# EAGLE schematic FloppyController (EAGLE 7.3.0)
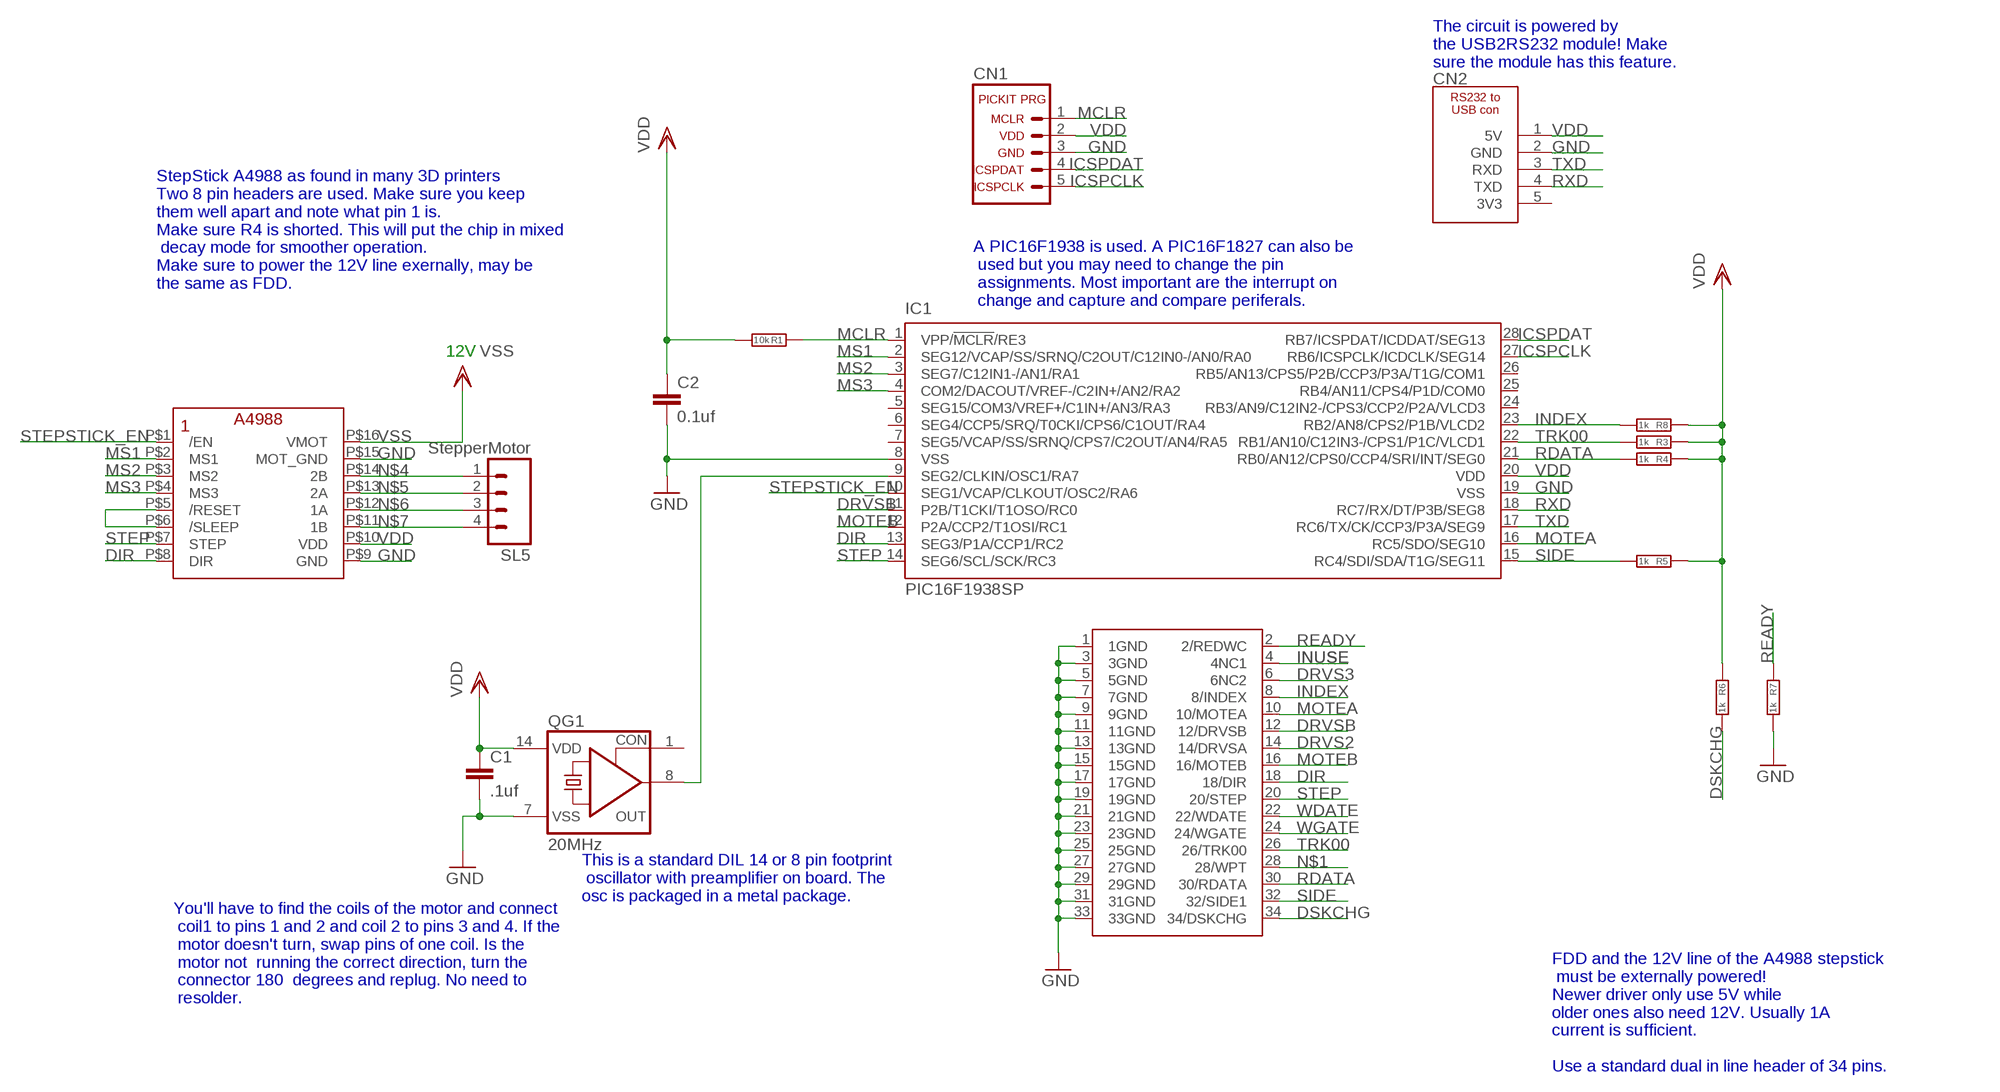
[diagram p0: schematic, sheet 1]

## Parts
C1  .1uf  C5/3  [C5B3]
C2  0.1uf  C5/3  [C5B3]
CN1  PICKIT3CONNECTOR  [05P]
CN2  RS232_TO_USB_CONNECTOR  [05P]
IC1  PIC16F1938SP  [DIL28-3]
IC2  STEPSTICK_A4988  [STEPSTICK_A4988]
QG1  20MHz  CRYSTAL_RES-SG51  [SG51]
R1  10k  R-EU_M1206  [M1206]
R3  1k  R-EU_M1206  [M1206]
R4  1k  R-EU_M1206  [M1206]
R5  1k  R-EU_M1206  [M1206]
R6  1k  R-EU_M1206  [M1206]
R7  1k  R-EU_M1206  [M1206]
R8  1k  R-EU_M1206  [M1206]
SL5  StepperMotor  M04  [04P]
U$1  FLOPPY_34PIN_CONN  [FLOPPY_34PIN_DUALROW]

## Nets
DIR: IC1.13(SEG3/P1A/CCP1/RC2) IC2.P$8(DIR) U$1.18(18/DIR)
DRVS2: U$1.14(14/DRVSA)
DRVS3: U$1.6(6NC2)
DRVSB: IC1.11(P2B/T1CKI/T1OSO/RC0) U$1.12(12/DRVSB)
DSKCHG: R6.1 U$1.34(34/DSKCHG)
GND: C1.2 C2.2 CN1.3(3_GND) CN2.2(GND) IC1.8(VSS) IC1.19(VSS) IC2.P$9(GND) IC2.P$15(MOT_GND) QG1.7(VSS) R7.1 U$1.1(1GND) U$1.3(3GND) U$1.5(5GND) U$1.7(7GND) U$1.9(9GND) U$1.11(11GND) U$1.13(13GND) U$1.15(15GND) U$1.17(17GND) U$1.19(19GND) U$1.21(21GND) U$1.23(23GND) U$1.25(25GND) U$1.27(27GND) U$1.29(29GND) U$1.31(31GND) U$1.33(33GND)
ICSPCLK: CN1.5(5_ICSPCLK) IC1.27(RB6/ICSPCLK/ICDCLK/SEG14)
ICSPDAT: CN1.4(4_ICSPDAT) IC1.28(RB7/ICSPDAT/ICDDAT/SEG13)
INDEX: IC1.23(RB2/AN8/CPS2/P1B/VLCD2) R8.1 U$1.8(8/INDEX)
INUSE: U$1.4(4NC1)
MCLR: CN1.1(1_MCLR) IC1.1(VPP/!MCLR!/RE3) R1.2
MOTEA: IC1.16(RC5/SDO/SEG10) U$1.10(10/MOTEA)
MOTEB: IC1.12(P2A/CCP2/T1OSI/RC1) U$1.16(16/MOTEB)
MS1: IC1.2(SEG12/VCAP/SS/SRNQ/C2OUT/C12IN0-/AN0/RA0) IC2.P$2(MS1)
MS2: IC1.3(SEG7/C12IN1-/AN1/RA1) IC2.P$3(MS2)
MS3: IC1.4(COM2/DACOUT/VREF-/C2IN+/AN2/RA2) IC2.P$4(MS3)
N$1: U$1.28(28/WPT)
N$4: IC2.P$14(2B) SL5.1
N$5: IC2.P$13(2A) SL5.2
N$6: IC2.P$12(1A) SL5.3
N$7: IC2.P$11(1B) SL5.4
N$14: IC1.9(SEG2/CLKIN/OSC1/RA7) QG1.8(OUT)
N$15: IC2.P$5(/RESET) IC2.P$6(/SLEEP)
RDATA: IC1.21(RB0/AN12/CPS0/CCP4/SRI/INT/SEG0) R4.1 U$1.30(30/RDATA)
READY: R7.2 U$1.2(2/REDWC)
RXD: CN2.4(TXD) IC1.18(RC7/RX/DT/P3B/SEG8)
SIDE: IC1.15(RC4/SDI/SDA/T1G/SEG11) R5.1 U$1.32(32/SIDE1)
STEP: IC1.14(SEG6/SCL/SCK/RC3) IC2.P$7(STEP) U$1.20(20/STEP)
STEPSTICK_EN: IC1.10(SEG1/VCAP/CLKOUT/OSC2/RA6) IC2.P$1(/EN)
TRK00: IC1.22(RB1/AN10/C12IN3-/CPS1/P1C/VLCD1) R3.1 U$1.26(26/TRK00)
TXD: CN2.3(RXD) IC1.17(RC6/TX/CK/CCP3/P3A/SEG9)
VDD: C1.1 C2.1 CN1.2(2_VDD) CN2.1(5V) IC1.20(VDD) IC2.P$10(VDD) QG1.14(VDD) R1.1 R3.2 R4.2 R5.2 R6.2 R8.2
VSS: IC2.P$16(VMOT)
WDATE: U$1.22(22/WDATE)
WGATE: U$1.24(24/WGATE)
Unconnected: CN2.5(3V3) IC1.5(SEG15/COM3/VREF+/C1IN+/AN3/RA3) IC1.6(SEG4/CCP5/SRQ/T0CKI/CPS6/C1OUT/RA4) IC1.7(SEG5/VCAP/SS/SRNQ/CPS7/C2OUT/AN4/RA5) IC1.24(RB3/AN9/C12IN2-/CPS3/CCP2/P2A/VLCD3) IC1.25(RB4/AN11/CPS4/P1D/COM0) IC1.26(RB5/AN13/CPS5/P2B/CCP3/P3A/T1G/COM1) QG1.1(CON)

## Notes on the sheet
- The circuit is powered by
  the USB2RS232 module! Make
  sure the module has this feature.
- StepStick A4988 as found in many 3D printers
  Two 8 pin headers are used. Make sure you keep
  them well apart and note what pin 1 is.
  Make sure R4 is shorted. This will put the chip in mixed
   decay mode for smoother operation.
  Make sure to power the 12V line exernally, may be 
  the same as FDD.
- A PIC16F1938 is used. A PIC16F1827 can also be
   used but you may need to change the pin
   assignments. Most important are the interrupt on
   change and capture and compare periferals.
- 12V
- This is a standard DIL 14 or 8 pin footprint
   oscillator with preamplifier on board. The 
  osc is packaged in a metal package.
- You'll have to find the coils of the motor and connect
   coil1 to pins 1 and 2 and coil 2 to pins 3 and 4. If the
   motor doesn't turn, swap pins of one coil. Is the
   motor not  running the correct direction, turn the
   connector 180  degrees and replug. No need to
   resolder.
- FDD and the 12V line of the A4988 stepstick
   must be externally powered!
  Newer driver only use 5V while
  older ones also need 12V. Usually 1A
  current is sufficient. 
  
  Use a standard dual in line header of 34 pins.

## Library data of the parts
C1 C2 = capacitor-wima:C: CAPACITOR naming: grid - package width
CN1 = _MyComponents:PICKIT3CONNECTOR: PICKIT3 Programmer CONNECTOR; OC_FARNELL: unknown; OC_NEWARK: unknown
CN2 = _MyComponents:RS232_TO_USB_CONNECTOR
IC1 = microchip:PIC16F19*: Flash-Based, 8-Bit CMOS Microcontrollers wtih LCD Driver and nanoWatt XLP Technology Auto generated by make-symbol-device-package-bsdl.ulp Rev. 33 Source: http://ww1.microchip.com/downloads/en/DeviceDoc/41364D.pdf; MPN: PIC16F1938-I/SP; OC_FARNELL: 1755829; OC_NEWARK: 08R1949
IC2 = _MyComponents:STEPSTICK_A4988
QG1 = crystal:CRYSTAL_RES-: CRYSTAL RESONATOR; OC_FARNELL: unknown; OC_NEWARK: unknown
R1 R3-R8 = rcl:R-EU_: RESISTOR, European symbol
SL5 = con-amp-quick:M04: AMP QUICK CONNECTOR; OC_FARNELL: unknown; OC_NEWARK: unknown
U$1 = _MyComponents:FLOPPY_34PIN_CONN